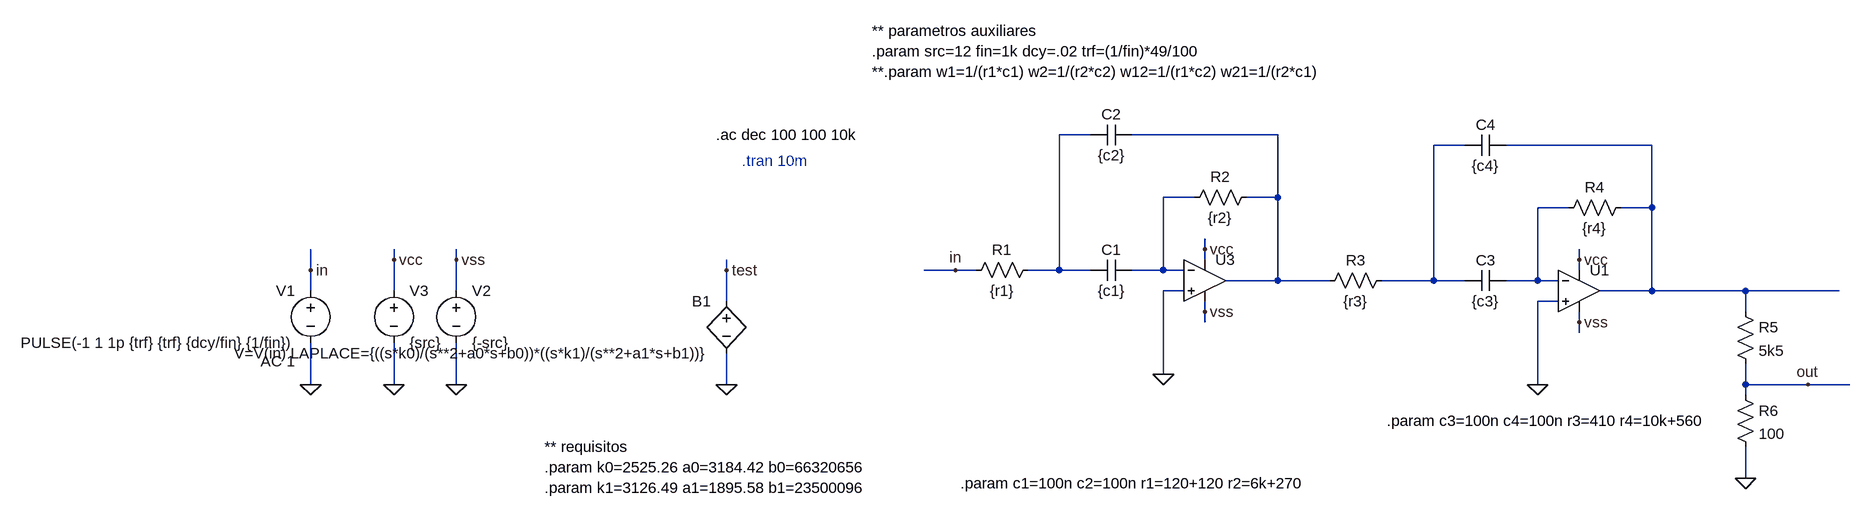
[diagram p0: schematic negFeddbackBP.asc]
negFeddbackBP.asc, the LTspice schematic file:
Version 4
SHEET 1 1924 680
WIRE 752 -304 704 -304
WIRE 1040 -304 816 -304
WIRE 1328 -288 1280 -288
WIRE 1616 -288 1392 -288
WIRE 912 -208 864 -208
WIRE 1040 -208 1040 -304
WIRE 1040 -208 992 -208
WIRE 1488 -192 1440 -192
WIRE 1616 -192 1616 -288
WIRE 1616 -192 1568 -192
WIRE 928 -128 928 -144
WIRE -320 -112 -320 -128
WIRE -224 -112 -224 -128
WIRE 928 -112 928 -128
WIRE 1504 -112 1504 -128
WIRE -448 -96 -448 -128
WIRE 192 -96 192 -112
WIRE 544 -96 496 -96
WIRE 576 -96 544 -96
WIRE 704 -96 704 -304
WIRE 704 -96 656 -96
WIRE 752 -96 704 -96
WIRE 864 -96 864 -208
WIRE 864 -96 816 -96
WIRE 896 -96 864 -96
WIRE 1504 -96 1504 -112
WIRE 1040 -80 1040 -208
WIRE 1040 -80 960 -80
WIRE 1120 -80 1040 -80
WIRE 1280 -80 1280 -288
WIRE 1280 -80 1200 -80
WIRE 1328 -80 1280 -80
WIRE 1440 -80 1440 -192
WIRE 1440 -80 1392 -80
WIRE 1472 -80 1440 -80
WIRE -448 -64 -448 -96
WIRE -320 -64 -320 -112
WIRE -224 -64 -224 -112
WIRE 896 -64 864 -64
WIRE 1616 -64 1616 -192
WIRE 1616 -64 1536 -64
WIRE 1760 -64 1616 -64
WIRE 1904 -64 1760 -64
WIRE 192 -48 192 -96
WIRE 1472 -48 1440 -48
WIRE 928 -32 928 -48
WIRE 1760 -32 1760 -64
WIRE 928 -16 928 -32
WIRE 1504 -16 1504 -32
WIRE 1504 0 1504 -16
WIRE 864 64 864 -64
WIRE -448 80 -448 16
WIRE -320 80 -320 16
WIRE -224 80 -224 16
WIRE 192 80 192 32
WIRE 1440 80 1440 -48
WIRE 1760 80 1760 48
WIRE 1856 80 1760 80
WIRE 1920 80 1856 80
WIRE 1760 96 1760 80
WIRE 1760 224 1760 176
FLAG -448 80 0
FLAG -224 80 0
FLAG -320 80 0
FLAG -320 -112 vcc
FLAG -224 -112 vss
FLAG -448 -96 in
FLAG 192 80 0
FLAG 928 -128 vcc
FLAG 928 -32 vss
FLAG 864 64 0
FLAG 192 -96 test
FLAG 1504 -112 vcc
FLAG 1504 -16 vss
FLAG 1440 80 0
FLAG 1856 80 out
FLAG 544 -96 in
FLAG 1760 224 0
SYMBOL voltage -448 -80 M0
WINDOW 123 24 124 Left 2
WINDOW 39 0 0 Left 0
SYMATTR Value2 AC 1
SYMATTR InstName V1
SYMATTR Value PULSE(-1 1 1p {trf} {trf} {dcy/fin} {1/fin})
SYMBOL voltage -224 -80 R0
WINDOW 123 0 0 Left 0
WINDOW 39 0 0 Left 0
SYMATTR InstName V2
SYMATTR Value {-src}
SYMBOL voltage -320 -80 R0
WINDOW 123 0 0 Left 0
WINDOW 39 0 0 Left 0
SYMATTR InstName V3
SYMATTR Value {src}
SYMBOL bv 192 -64 M0
SYMATTR InstName B1
SYMATTR Value V=V(in) LAPLACE={((s*k0)/(s**2+a0*s+b0))*((s*k1)/(s**2+a1*s+b1))}
SYMBOL OpAmps\\UniversalOpamp 928 -80 R0
SYMATTR InstName U3
SYMBOL res 672 -112 R90
WINDOW 0 0 56 VBottom 2
WINDOW 3 32 56 VTop 2
SYMATTR InstName R1
SYMATTR Value {r1}
SYMBOL res 1008 -224 R90
WINDOW 0 0 56 VBottom 2
WINDOW 3 32 56 VTop 2
SYMATTR InstName R2
SYMATTR Value {r2}
SYMBOL cap 816 -112 R90
WINDOW 0 0 32 VBottom 2
WINDOW 3 32 32 VTop 2
SYMATTR InstName C1
SYMATTR Value {c1}
SYMBOL cap 816 -320 R90
WINDOW 0 0 32 VBottom 2
WINDOW 3 32 32 VTop 2
SYMATTR InstName C2
SYMATTR Value {c2}
SYMBOL OpAmps\\UniversalOpamp 1504 -64 R0
SYMATTR InstName U1
SYMBOL res 1216 -96 R90
WINDOW 0 0 56 VBottom 2
WINDOW 3 32 56 VTop 2
SYMATTR InstName R3
SYMATTR Value {r3}
SYMBOL res 1584 -208 R90
WINDOW 0 0 56 VBottom 2
WINDOW 3 32 56 VTop 2
SYMATTR InstName R4
SYMATTR Value {r4}
SYMBOL cap 1392 -96 R90
WINDOW 0 0 32 VBottom 2
WINDOW 3 32 32 VTop 2
SYMATTR InstName C3
SYMATTR Value {c3}
SYMBOL cap 1392 -304 R90
WINDOW 0 0 32 VBottom 2
WINDOW 3 32 32 VTop 2
SYMATTR InstName C4
SYMATTR Value {c4}
SYMBOL res 1744 -48 R0
SYMATTR InstName R5
SYMATTR Value 5k5
SYMBOL res 1744 80 R0
SYMATTR InstName R6
SYMATTR Value 100
TEXT 176 -304 Left 2 !.ac dec 100 100 10k
TEXT 216 -264 Left 2 ;.tran 10m
TEXT 416 -464 Left 2 !** parametros auxiliares\n.param src=12 fin=1k dcy=.02 trf=(1/fin)*49/100\n**.param w1=1/(r1*c1) w2=1/(r2*c2) w12=1/(r1*c2) w21=1/(r2*c1)
TEXT -88 176 Left 2 !** requisitos\n.param k0=2525.26 a0=3184.42 b0=66320656\n.param k1=3126.49 a1=1895.58 b1=23500096
TEXT 552 232 Left 2 !.param c1=100n c2=100n r1=120+120 r2=6k+270
TEXT 1208 136 Left 2 !.param c3=100n c4=100n r3=410 r4=10k+560

The netlist it stands for:
* negFeddbackBP.asc
V1 in 0 PULSE(-1 1 1p {trf} {trf} {dcy/fin} {1/fin}) AC 1
V2 vss 0 {-src}
V3 vcc 0 {src}
B1 test 0 V=V(in) LAPLACE={((s*k0)/(s**2+a0*s+b0))*((s*k1)/(s**2+a1*s+b1))}
XU3 0 N005 vcc vss N002 level1 Avol=1Meg GBW=10Meg Vos=0 En=0 Enk=0 In=0 Ink=0 Rin=500Meg  ; pins In+ In- V+ V- OUT
R1 N001 in {r1}
R2 N002 N005 {r2}
C1 N005 N001 {c1}
C2 N002 N001 {c2}
XU1 0 N006 vcc vss N004 level1 Avol=1Meg GBW=10Meg Vos=0 En=0 Enk=0 In=0 Ink=0 Rin=500Meg  ; pins In+ In- V+ V- OUT
R3 N003 N002 {r3}
R4 N004 N006 {r4}
C3 N006 N003 {c3}
C4 N004 N003 {c4}
R5 N004 out 5k5
R6 out 0 100
.ac dec 100 100 10k
* .tran 10m
** parametros auxiliares
.param src=12 fin=1k dcy=.02 trf=(1/fin)*49/100
**.param w1=1/(r1*c1) w2=1/(r2*c2) w12=1/(r1*c2) w21=1/(r2*c1)
** requisitos
.param k0=2525.26 a0=3184.42 b0=66320656
.param k1=3126.49 a1=1895.58 b1=23500096
.param c1=100n c2=100n r1=120+120 r2=6k+270
.param c3=100n c4=100n r3=410 r4=10k+560
.lib UniversalOpAmp1.lib
.backanno
.end